# Altium schematic sheet SPI_IFC.SchDoc: =Project
size 420 x 297 mm; Author: G.Kasprowicz; CompanyName: WUT ISE; DrawnBy: G.Kasprowicz; Organization: WUT ISE; Address1: PW ISE; Address2: Nowowiejska 15/19 00-665 Warsaw; Address3: gkasprow@gmail.com; SheetNumber: -; SheetTotal: -; ModifiedBy: -; CheckedDate: -; Title2: SPI IFC; DivGrp: WUT ISE; Designer: G.Kasprowicz; SPICEModelCacheRYPVXPCY: <root> / <DocumentId>RYPVXPCY</DocumentId> / </root>; ModifiedDate: -; ProjectName: Sensor Box
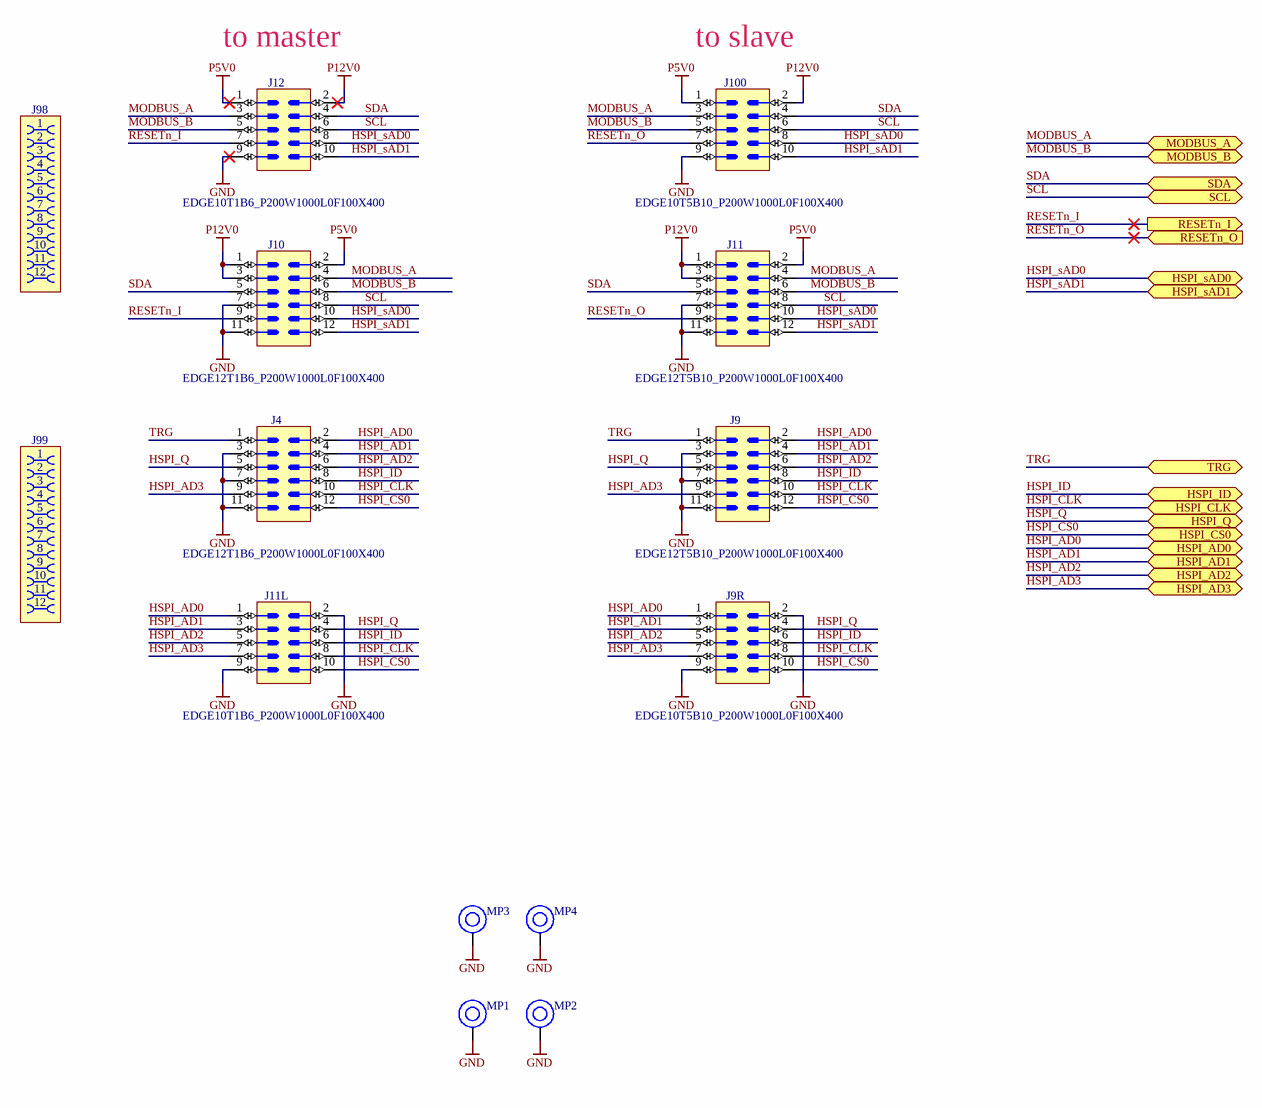
[diagram p0: SPI_IFC.SchDoc]

## Parts
J4  (no value)  [EDGE12T1B6_P200W1000L0F100X400]
J9  (no value)  [EDGE12T5B10_P200W1000L0F100X400]
J9R  (no value)  [EDGE10T5B10_P200W1000L0F100X400]
J10  (no value)  [EDGE12T1B6_P200W1000L0F100X400]
J11  (no value)  [EDGE12T5B10_P200W1000L0F100X400]
J11L  (no value)  [EDGE10T1B6_P200W1000L0F100X400]
J12  (no value)  [EDGE10T1B6_P200W1000L0F100X400]
J98  (no value)  [AVX_009159012761916]
J99  (no value)  [AVX_009159012761916]
J100  (no value)  [EDGE10T5B10_P200W1000L0F100X400]
MP1  M1.6 x 3mm  [97730306330]  (value not drawn)
MP2  M1.6 x 3mm  [97730306330]  (value not drawn)
MP3  M1.6 x 3mm  [97730306330]  (value not drawn)
MP4  M1.6 x 3mm  [97730306330]  (value not drawn)

## Ports
HSPI_AD0 (bidir), HSPI_AD1 (bidir), HSPI_AD2 (bidir), HSPI_AD3 (bidir), HSPI_CLK (bidir), HSPI_CS0 (bidir), HSPI_ID (bidir), HSPI_Q (bidir), HSPI_sAD0 (bidir), HSPI_sAD1 (bidir), MODBUS_A (bidir), MODBUS_B (bidir), RESETn_I (out), RESETn_O (in), SCL (bidir), SDA (bidir), TRG (bidir)

## Nets
GND: J4.3 J4.7 J4.11 J9.3 J9.7 J9.11 J9R.2 J9R.9 J10.7 J10.11 J11.7 J11.11 J11L.2 J11L.9 J12.9 J100.9 MP1.1 MP2.1 MP3.1 MP4.1
P5V0: J10.2 J11.2 J12.1 J100.1
P12V0: J10.1 J10.3 J11.1 J11.3 J12.2 J100.2
HSPI_AD0: J4.2 J9.2 J9R.1 J11L.1 ; port HSPI_AD0
HSPI_AD1: J4.4 J9.4 J9R.3 J11L.3 ; port HSPI_AD1
HSPI_AD2: J4.6 J9.6 J9R.5 J11L.5 ; port HSPI_AD2
HSPI_AD3: J4.9 J9.9 J9R.7 J11L.7 ; port HSPI_AD3
HSPI_CLK: J4.10 J9.10 J9R.8 J11L.8 ; port HSPI_CLK
HSPI_CS0: J4.12 J9.12 J9R.10 J11L.10 ; port HSPI_CS0
HSPI_ID: J4.8 J9.8 J9R.6 J11L.6 ; port HSPI_ID
HSPI_Q: J4.5 J9.5 J9R.4 J11L.4 ; port HSPI_Q
HSPI_sAD0: J10.10 J11.10 J12.8 J100.8 ; port HSPI_sAD0
HSPI_sAD1: J10.12 J11.12 J12.10 J100.10 ; port HSPI_sAD1
MODBUS_A: J10.4 J11.4 J12.3 J100.3 ; port MODBUS_A
MODBUS_B: J10.6 J11.6 J12.5 J100.5 ; port MODBUS_B
RESETn_I: J10.9 J12.7 ; port RESETn_I
RESETn_O: J11.9 J100.7 ; port RESETn_O
SCL: J10.8 J11.8 J12.6 J100.6 ; port SCL
SDA: J10.5 J11.5 J12.4 J100.4 ; port SDA
TRG: J4.1 J9.1 ; port TRG

## Notes on the sheet
- (near J12) to master
- (near J100) to slave
- Project/Equipment
- Document
- Designer
- Drawn by
- Check.by
- Copyright WUT ISE 2018.
  This documentation describes Open Hardware and is licensed under the CERN OHL v.1.1. You may redistribute and modify this documentation under the terms of the CERN OHL v.1.1. (http://ohwr.org/CERNOHL). This documentation is distributed WITHOUT ANY EXPRESS OR IMPLIED WARRANTY, INCLUDING OF MERCHANTABILITY, SATISFACTORY QUALITY AND FITNESS FOR A PARTICULAR PURPOSE. Please see the CERN OHL v.1.1 for applicable conditions.
- Contact
- File
- Last Mod.
- Print Date
- Sheet
- Size
- A3
- of
- Rev
- (in symbol AVX_009159012761916) 11

## Library data of the parts
J4 J10 = PCB Edge Connector 12 (2x6): Part Number: EDGE10T1B6_P200W1000L0F100X400; Part Description: 10 Contacts Board Edge Connector, Pitch 2mm, Length 0mm, Width 10mm, Finger Lenght 4mm, Finger Width 1mm; Mounted: No; PressFit: No; Component Kind: Standard (No BOM); Component Type: Standard (No BOM); Pin Count: 12; Socket: No; SMD: No; Sense: No; Status: None; ComponentHeight: 0mm; HelpURL: \\cern.ch\dfs\Applications\Altium\Datasheets\EDGE10T1B6_P200W1000L0F100X400.pdf; Author: CERN DEM MR; CreateDate: 14.02.2018; LatestRevisionDate: 14.02.2018
J9 J11 = PCB Edge Connector 12 (2x6) R: PCB Edge Connector 12 (2x6); Part Description: 12 Contacts Board Edge Connector, Pitch 2mm, Length 0mm, Width 10mm, Finger Lenght 4mm, Finger Width 1mm; Mounted: No; PressFit: No; Part Number: EDGE12T5B10_P200W1000L0F100X400; Component Kind: Standard (No BOM); Component Type: Standard (No BOM); Pin Count: 12; Socket: No; SMD: No; Sense: No; Status: None; ComponentHeight: 0mm; HelpURL: \\cern.ch\dfs\Applications\Altium\Datasheets\EDGE10T5B10_P200W1000L0F100X400.pdf; Author: GK; CreateDate: 14.02.2018; LatestRevisionDate: 14.02.2018
J9R J100 = EDGE10T5B10_P200W1000L0F100X400: PCB Edge Connector 10 (2x5); Part Description: 10 Contacts Board Edge Connector, Pitch 2mm, Length 0mm, Width 10mm, Finger Lenght 4mm, Finger Width 1mm; Mounted: No; PressFit: No; Part Number: EDGE10T5B10_P200W1000L0F100X400; Component Kind: Standard (No BOM); Component Type: Standard (No BOM); Pin Count: 10; Socket: No; SMD: No; Sense: No; Status: None; ComponentHeight: 0mm; HelpURL: \\cern.ch\dfs\Applications\Altium\Datasheets\EDGE10T5B10_P200W1000L0F100X400.pdf; Author: CERN DEM MR; CreateDate: 14.02.2018; LatestRevisionDate: 14.02.2018
J11L J12 = EDGE10T1B6_P200W1000L0F100X400: PCB Edge Connector 10 (2x5); Part Description: 10 Contacts Board Edge Connector, Pitch 2mm, Length 0mm, Width 10mm, Finger Lenght 4mm, Finger Width 1mm; Mounted: No; PressFit: No; Part Number: EDGE10T1B6_P200W1000L0F100X400; Component Kind: Standard (No BOM); Component Type: Standard (No BOM); Pin Count: 10; Socket: No; SMD: No; Sense: No; Status: None; ComponentHeight: 0mm; HelpURL: \\cern.ch\dfs\Applications\Altium\Datasheets\EDGE10T1B6_P200W1000L0F100X400.pdf; Author: CERN DEM MR; CreateDate: 14.02.2018; LatestRevisionDate: 14.02.2018
J98 J99 = AVX_009159012761916: Open Ended Card Edge Connector, 9159 Series; Part Number: AVX_0009159012761916; Part Description: 10 Contacts, 2mm Pitch, Open Ended Card Edge Connector, 9159 Series; Manufacturer: AVX; PressFit: No; Component Kind: Standard; Component Type: Standard; Pin Count: 12; Mounted: Yes; Socket: No; SMD: No; Sense: No; Status: None; Manufacturer Part Number: 009159012761916; ComponentHeight: 1.6mm; HelpURL: \\cern.ch\dfs\Applications\Altium\Datasheets\AVX_00 9159 010 061 916.pdf; Author: GK; CreateDate: 13.02.2018; LatestRevisionDate: 13.02.2018
MP1-MP4 = 97730306330R: WA-SMSI SMT Steel Spacer with internal Thread Bottom closed, OD 3.3mm, M1.6 x 3mm; Manufacturer: Wurth Elektronik; Inside Thread Length: 1.8mm; Surface: Tin; ComponentLink1Description: Website Link; ComponentLink1URL: https://www.we-online.com/redexpert/article/97730306330R?ad; ComponentLink2Description: Datasheet Link; ComponentLink2URL: https://www.we-online.com/redexpert/spec/97730306330R?ad; Manufacturer Part Number: 97730306330R; Category: SMT Spacers; Match Code: WA-SMSI; Mount: Surface Mount; Operating Temperature Max: 150°C; Operating Temperature Min: -55°C; Packaging: Tape and Reel; Height: 3mm; Material: Steel; Outside Diameter: 3.3mm; Thread Size: M1.6